# Altium project HUST_BL702_Demo.PrjPcb
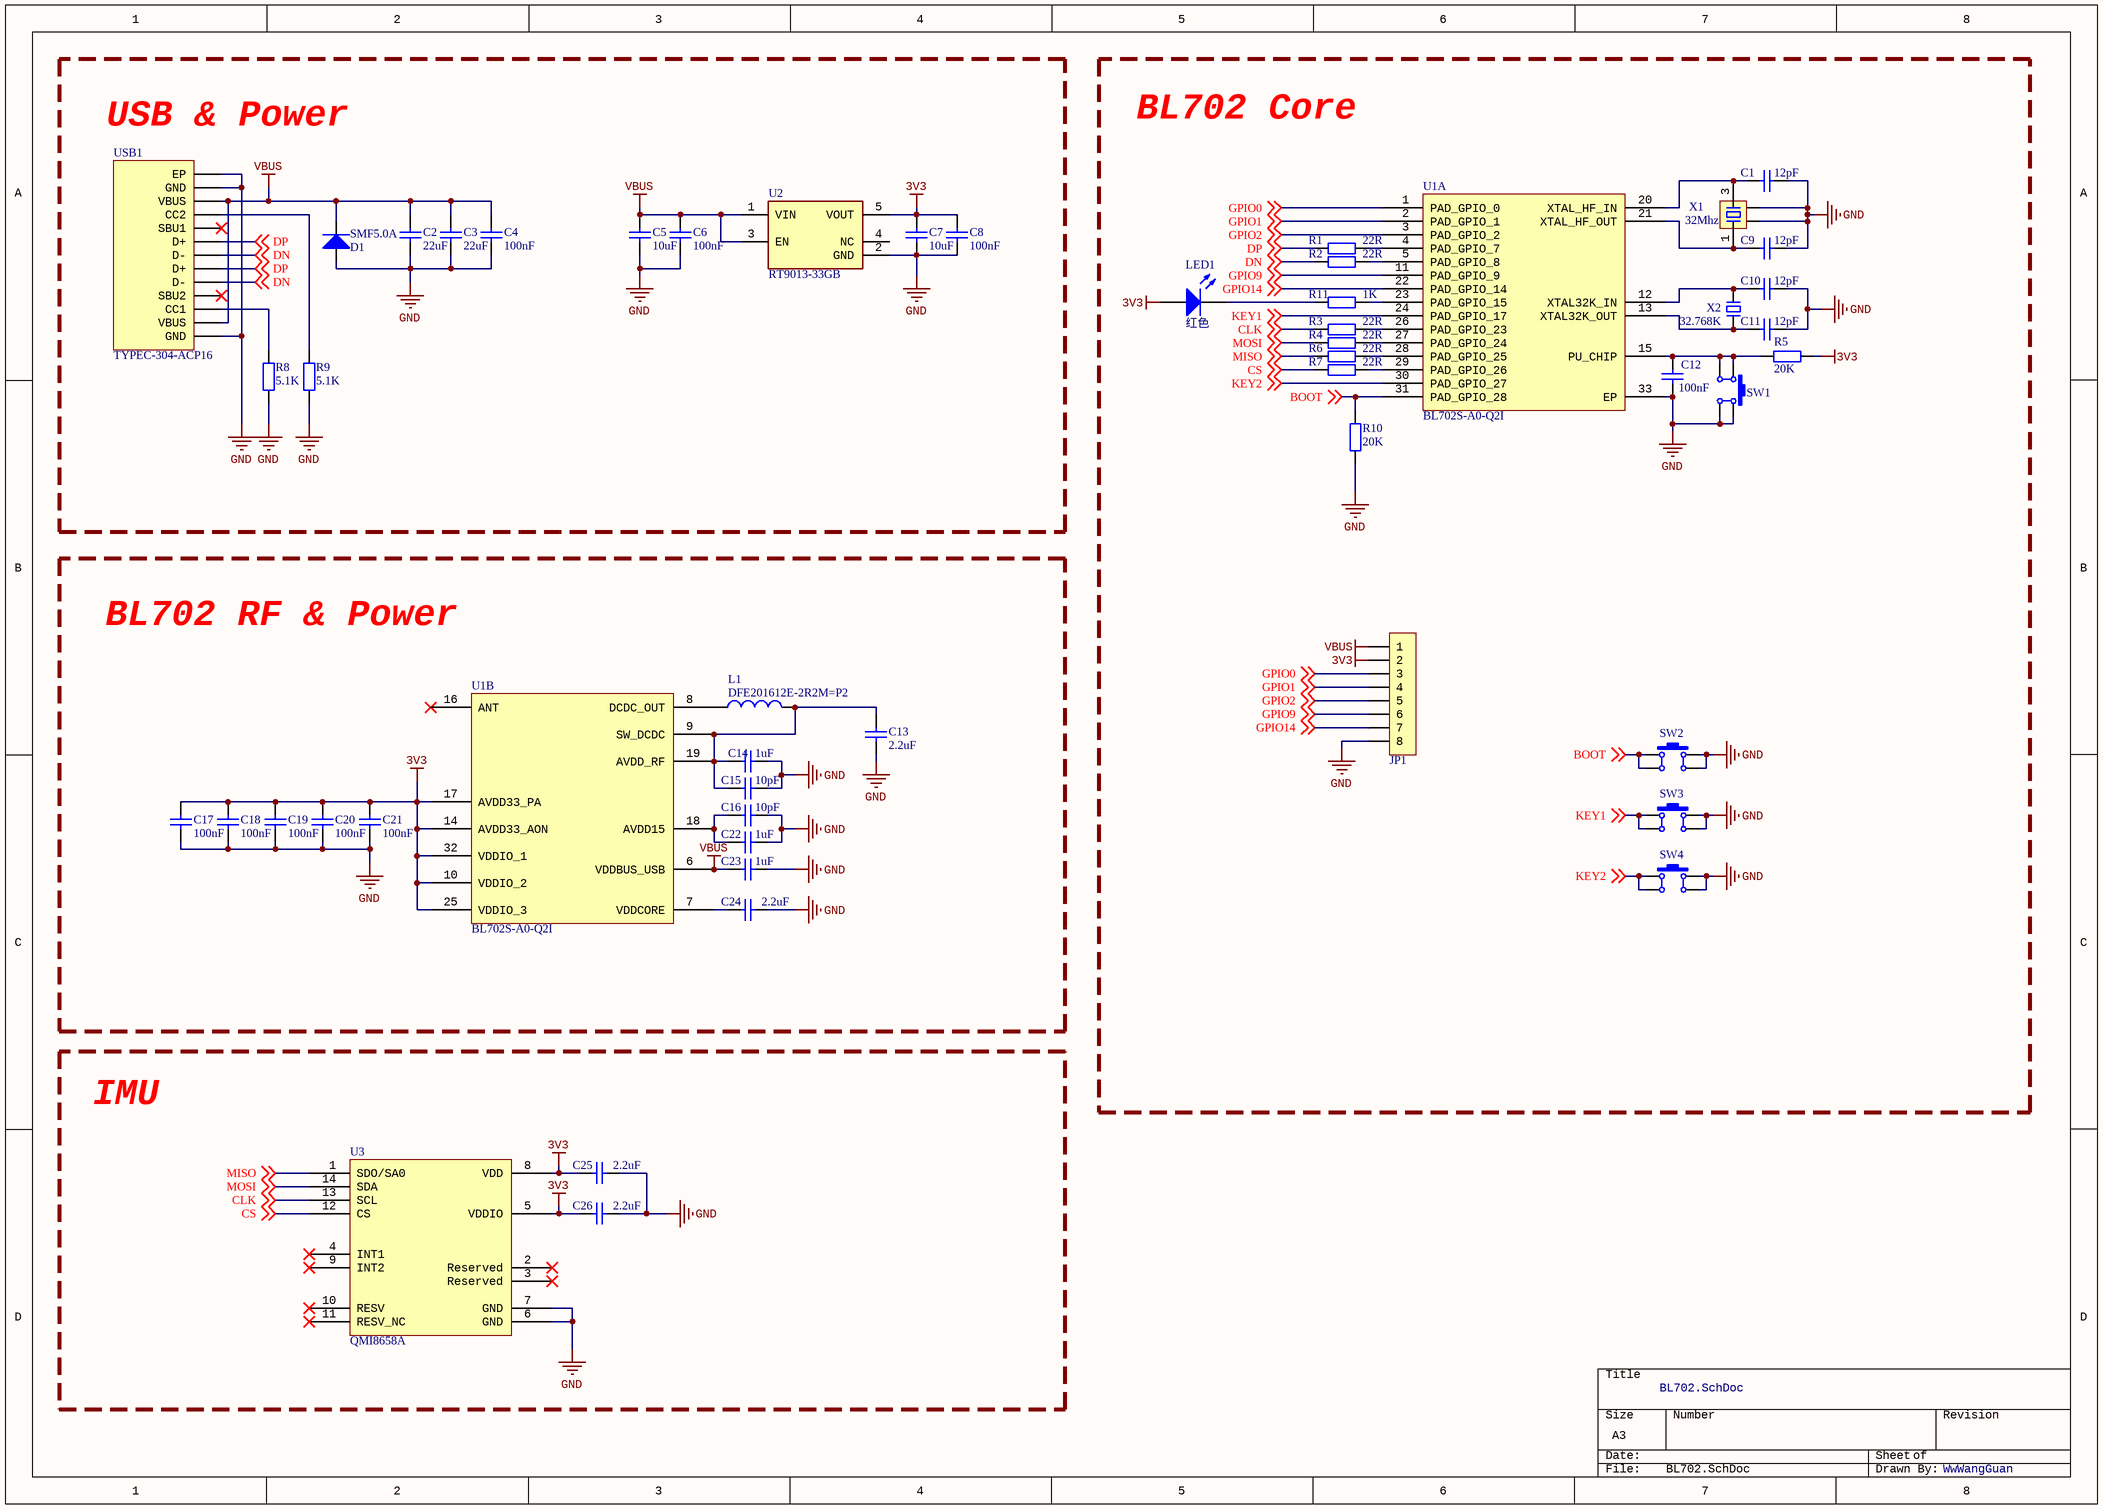
[diagram p0: BL702.SchDoc]
1 sheet, 51 parts. Net scope: global (net labels, ports and power ports of the same name join across sheets).
Board file: BL702.PcbDoc

## Sheet BL702.SchDoc
size A3; Author: WwWangGuan; SheetNumber: 1; SheetTotal: 1

### Parts
C1  12pF  [C0402_L]
C2  22uF  [C0603_L]
C3  22uF  [C0603_L]
C4  100nF  [C0603_L]
C5  10uF  [C0603_L]
C6  100nF  [C0603_L]
C7  10uF  [C0603_L]
C8  100nF  [C0603_L]
C9  12pF  [C0402_L]
C10  12pF  [C0402_L]
C11  12pF  [C0402_L]
C12  100nF  [C0402_L]
C13  2.2uF  [C0402_L]
C14  1uF  [C0402_L]
C15  10pF  [C0402_L]
C16  10pF  [C0402_L]
C17  100nF  [C0402_L]
C18  100nF  [C0402_L]
C19  100nF  [C0402_L]
C20  100nF  [C0402_L]
C21  100nF  [C0402_L]
C22  1uF  [C0402_L]
C23  1uF  [C0402_L]
C24  2.2uF  [C0402_L]
C25  2.2uF  [C0402_L]
C26  2.2uF  [C0402_L]
D1  SMF5.0A  [SOD-123]
JP1  HDR-1X8  [HDR2.54-LI-8P]  (value not drawn)
L1  DFE201612E-2R2M=P2  [FP-DFE201612C-IPC_B]
LED1  红色  [LED0603_R]
R1  22R  [R0402_L]
R2  22R  [R0402_L]
R3  22R  [R0402_L]
R4  22R  [R0402_L]
R5  20K  [R0402_L]
R6  22R  [R0402_L]
R7  22R  [R0402_L]
R8  5.1K  [R0402_L]
R9  5.1K  [R0402_L]
R10  20K  [R0402_L]
R11  1K  [R0402_L]
SW1  3*4*2.5  [SW-SMD-4.2x3.2_4P]  (value not drawn)
SW2  3*4*2.5  [SW-SMD-4.2x3.2_4P]  (value not drawn)
SW3  3*4*2.5  [SW-SMD-4.2x3.2_4P]  (value not drawn)
SW4  3*4*2.5  [SW-SMD-4.2x3.2_4P]  (value not drawn)
U1  BL702S-A0-Q2I  [QFN40P400X400X80_HS-33N]  (parts A,B of 2)
U2  RT9013-33GB  [SOT94P279X130-5N]
U3  QMI8658A  [PQFN50P300X250X86-14M]
USB1  TYPEC-304-ACP16  [TYPEC-304-ACP16-Footprint-1]
X1  32Mhz  [XTAL-3225-4P]
X2  32.768K  [XTAL-3215-2P]

### Blocks framed on the sheet
USB & Power: C2-C8 D1 R8 R9 U2 USB1
BL702 Core: C1 C9-C12 JP1 LED1 R1-R7 R10 R11 SW1-SW4 U1 X1 X2
BL702 RF & Power: C13-C24 L1 U1
IMU: C25 C26 U3

### Nets
3V3: C7.2 C8.2 C17.1 C18.1 C19.1 C20.1 C21.1 C25.2 C26.2 JP1.2 LED1.1(A) R5.1 U1.10(VDDIO_2) U1.14(AVDD33_AON) U1.17(AVDD33_PA) U1.25(VDDIO_3) U1.32(VDDIO_1) U2.5(VOUT) U3.5(VDDIO) U3.8(VDD)
GND: C1.1 C2.1 C3.1 C4.1 C5.1 C6.1 C7.1 C8.1 C9.1 C10.1 C11.1 C12.1 C13.1 C14.1 C15.2 C16.2 C17.2 C18.2 C19.2 C20.2 C21.2 C22.1 C23.2 C24.1 C25.1 C26.1 D1.1(A) JP1.8 R8.1 R9.1 R10.2 SW1.2 SW1.3 SW2.1 SW2.4 SW3.1 SW3.4 SW4.1 SW4.4 U1.33(EP) U2.2(GND) U3.6(GND) U3.7(GND) USB1.A1B12(GND) USB1.B1A12(GND) USB1.EP X1.2 X1.4
VBUS: C2.2 C3.2 C4.2 C5.2 C6.2 C23.1 D1.2(K) JP1.1 U1.6(VDDBUS_USB) U2.1(VIN) U2.3(EN) USB1.A4B9(VBUS) USB1.B4A9(VBUS)
BOOT: R10.1 SW2.2 SW2.3 U1.31(PAD_GPIO_28) ; off-sheet BOOT
CLK: R3.2 U3.13(SCL) ; off-sheet CLK
CS: R7.2 U3.12(CS) ; off-sheet CS
DN: R2.2 USB1.A7(D-) USB1.B7(D-) ; off-sheet DN
DP: R1.2 USB1.A6(D+) USB1.B6(D+) ; off-sheet DP
GPIO0: JP1.3 U1.1(PAD_GPIO_0) ; off-sheet GPIO0
GPIO1: JP1.4 U1.2(PAD_GPIO_1) ; off-sheet GPIO1
GPIO2: JP1.5 U1.3(PAD_GPIO_2) ; off-sheet GPIO2
GPIO9: JP1.6 U1.11(PAD_GPIO_9) ; off-sheet GPIO9
GPIO14: JP1.7 U1.22(PAD_GPIO_14) ; off-sheet GPIO14
KEY1: SW3.2 SW3.3 U1.24(PAD_GPIO_17) ; off-sheet KEY1
KEY2: SW4.2 SW4.3 U1.30(PAD_GPIO_27) ; off-sheet KEY2
MISO: R6.2 U3.1(SDO/SA0) ; off-sheet MISO
MOSI: R4.2 U3.14(SDA) ; off-sheet MOSI
NetC1_2: C1.2 U1.20(XTAL_HF_IN) X1.3
NetC9_2: C9.2 U1.21(XTAL_HF_OUT) X1.1
NetC10_2: C10.2 U1.12(XTAL32K_IN) X2.2
NetC11_2: C11.2 U1.13(XTAL32K_OUT) X2.1
NetC12_2: C12.2 R5.2 SW1.1 SW1.4 U1.15(PU_CHIP)
NetC13_2: C13.2 C14.2 C15.1 L1.2 U1.9(SW_DCDC) U1.19(AVDD_RF)
NetC16_1: C16.1 C22.2 U1.18(AVDD15)
NetC24_2: C24.2 U1.7(VDDCORE)
NetL1_1: L1.1 U1.8(DCDC_OUT)
NetLED1_2: LED1.2(K) R11.2
NetR1_1: R1.1 U1.4(PAD_GPIO_7)
NetR2_1: R2.1 U1.5(PAD_GPIO_8)
NetR3_1: R3.1 U1.26(PAD_GPIO_23)
NetR4_1: R4.1 U1.27(PAD_GPIO_24)
NetR6_1: R6.1 U1.28(PAD_GPIO_25)
NetR7_1: R7.1 U1.29(PAD_GPIO_26)
NetR8_2: R8.2 USB1.A5(CC1)
NetR9_2: R9.2 USB1.B5(CC2)
NetR11_1: R11.1 U1.23(PAD_GPIO_15)

Not connected (* = marked no-connect by the designer): U1 16(ANT)*; U2 4(NC); U3 2(Reserved)* 3(Reserved)* 4(INT1)* 9(INT2)* 10(RESV)* 11(RESV_NC)*; USB1 A8(SBU1)* B8(SBU2)*

### Library data of the parts
C1-C26 = C: 贴片电容/MLCC电容; BOM名称: 无极性贴片电容; 当前库版本V2023.5.31 @淘宝卖家:黄晶宝石: 最新版本发布https://item.taobao.com/item.htm?id=566775463719
D1 = TVS: TVS通用; 当前库版本V2023.5.31 @淘宝卖家:黄晶宝石: 最新版本发布https://shop463601444.taobao.com
JP1 = Header 8: 8P接插件; 联系卖家，免费查找封装: 唯一出售店铺网址https://shop463601444.taobao.com; 封装库来自淘宝卖家ID：黄晶宝石: 其他店铺购入均为盗版封装库，请立即申请退款，本店现金奖励50~200元; BOM名称: 8P接插件
L1 = CMP-005-00013-1: Inductor Power Shielded Wirewound 2.2uH 20% 1MHz Metal 1.8A 0.116Ohm DCR 0806 T/R; Current Rating: 1.8A; RoHS Compliant: Yes; Max Operating Temperature: 125°C; Min Operating Temperature: -40°C
LED1 = LED: 贴片LED; 封装库来自淘宝卖家：黄晶宝石: 其他店铺购入均为盗版封装库，无更新权益，请立即申请退款，本店现金奖励200~1000元; BOM名称: 贴片LED
R1-R11 = R: 贴片电阻; 联系下单店铺卖家 免费帮你查找封装: 联系下单店铺卖家 免费技术支持; BOM名称: 贴片电阻
SW1-SW4 = SW SMD-3*4*2.5: 贴片4脚轻触开关; 联系下单店铺卖家 免费技术支持: 联系下单店铺卖家 免费帮你查找封装
U1 = CMP-020-00038-5: BL702
U2 = RT9013-33GB: Power Supply; Manufacturer_Name: RICHTEK; Datasheet Link: https://www.richtek.com/assets/product_file/RT9013/DS9013-10.pdf; Height: 1.295mm; Manufacturer_Part_Number: RT9013-33GB; Mouser Part Number: 835-RT9013-33GB; Mouser Price/Stock: https://www.mouser.co.uk/ProductDetail/Richtek/RT9013-33GB?qs=amGC7iS6iy%2FHaDkSgZH71g%3D%3D
U3 = CMP-031-00013-1
USB1 = CMP-002-00343-1: 3A 1 Horizontal attachment 16P Female -40℃~+85℃ Gold Copper Type-C SMD USB Connectors ROHS
X1 = XTAL-4P: 4脚无源晶振(谐振器）; 联系下单店铺卖家 免费帮你查找封装: 联系下单店铺卖家 免费技术支持; BOM名称: 4脚无源晶振(谐振器）
X2 = XTAL-2P: 2脚无源晶振(谐振器）; 联系下单店铺卖家 免费帮你查找封装: 联系下单店铺卖家 免费技术支持; BOM名称: 2脚无源晶振(谐振器）